# Altium schematic sheet US_SB_Orinet.SchDoc
size A4
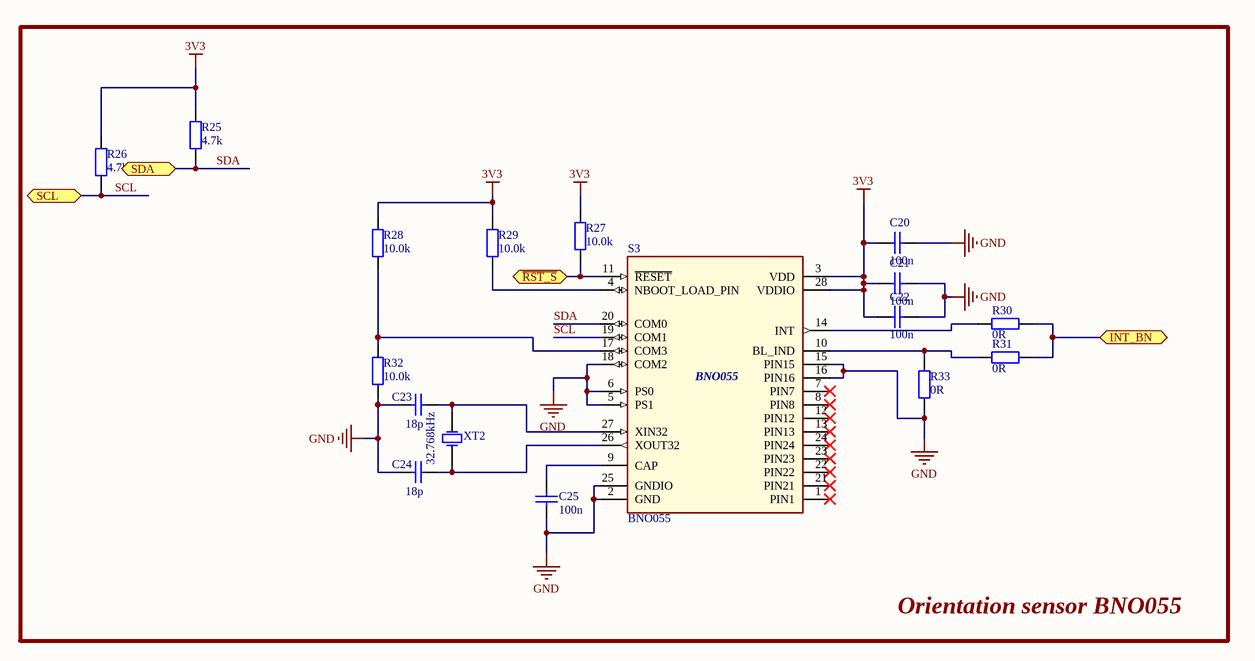
[diagram p0: US_SB_Orinet.SchDoc]

## Parts
C20  100n  [C0603_IPC_HD]
C21  100n  [C0603_IPC_HD]
C22  100n  [C0603_IPC_HD]
C23  18p  [C0603_IPC_HD]
C24  18p  [C0603_IPC_HD]
C25  100n  [C0603_IPC_HD]
R25  4.7k  [R0603_IPC_HD]
R26  4.7k  [R0603_IPC_HD]
R27  10.0k  [R0603_IPC_MD]
R28  10.0k  [R0603_IPC_MD]
R29  10.0k  [R0603_IPC_MD]
R30  0R  [R0603_IPC_MD]
R31  0R  [R0603_IPC_MD]  (no BOM)
R32  10.0k  [R0603_IPC_MD]
R33  0R  [R0603_IPC_MD]
S3  BNO055  [BNO055_LGA28R50P4X10_380X520X100]
XT2  32.768kHz  [FC-135R]

## Blocks framed on the sheet
Orientation sensor BNO055: C20-C25 R25-R33 S3 XT2

## Ports
INT_BN, SCL, SDA, ~{RST_S}

## Nets
3V3: C20.1 C21.1 C22.1 R25.2 R26.2 R27.2 R28.2 R29.2 S3.3(VDD) S3.28(VDDIO)
GND: C20.2 C21.2 C22.2 C23.1 C24.1 C25.1 R32.1 R33.1 S3.2(GND) S3.5(PS1) S3.6(PS0) S3.15(PIN15) S3.16(PIN16) S3.18(COM2) S3.25(GNDIO)
~{RST_S}: R27.1 S3.11(~{RESET}) ; port ~{RST_S}
INT_BN: R30.1 R31.1 ; port INT_BN
SCL: R26.1 S3.19(COM1) ; port SCL
SDA: R25.1 S3.20(COM0) ; port SDA
NetC23_2: C23.2 S3.27(XIN32) XT2.2(OSC2)
NetC24_2: C24.2 S3.26(XOUT32) XT2.1(OSC1)
NetC25_2: C25.2 S3.9(CAP)
NetR28_1: R28.1 R32.2 S3.17(COM3)
NetR29_1: R29.1 S3.4(NBOOT_LOAD_PIN)
NetR30_2: R30.2 S3.14(INT)
NetR31_2: R31.2 R33.2 S3.10(BL_IND)

Not connected (* = marked no-connect by the designer): S3 1(PIN1)* 7(PIN7)* 8(PIN8)* 12(PIN12)* 13(PIN13)* 21(PIN21)* 22(PIN22)* 23(PIN23)* 24(PIN24)*

## Library data of the parts
C20-C22 C25 = CL10B104KO8NNNC: CAP CER 0.1UF 16V X7R 0603; Manufacturer: Samsung Electro-Mechanics; Manufacturer Part Number: CL10B104KO8NNNC; Voltage: 16V; Value: 100n; Dielectric: X7R; Supplier 1: Digi-Key; Supplier Part Number 1: 1276-1005-1-ND
C23 C24 = CL10C180JB8NNNC: CAP CER 18PF 50V C0G/NP0 0603; Manufacturer: Samsung Electro-Mechanics; Manufacturer Part Number: CL10C180JB8NNNC; Voltage: 50V; Value: 18p; Dielectric: C0G/NP0; Supplier 1: Digi-Key; Supplier Part Number 1: 1276-1089-1-ND
R25 R26 = CR0603-JW-4.7k: RES SMD 4.7K OHM 5% 1/10W 0603; Manufacturer: Bourns Inc.; Manufacturer Part Number: CR0603-JW-472ELF; Value: 4.7k; Tolarance: ±5%; Supplier 1: Digi-Key; Supplier Part Number 1: CR0603-JW-472ELFCT-ND
R27-R29 R32 = RMCF0603FT10K0: RES 10K OHM 1% 1/10W 0603; Manufacturer: Stackpole Electronics Inc; Value: 10.0k; Tolarance: 1%; Manufacturer Part Number: RMCF0603FT10K0; Supplier 1: Digi-Key; Supplier Part Number 1: RMCF0603FT10K0CT-ND
R30 R31 R33 = CR0603-J/-000ELF: RES SMD 0 OHM JUMPER 1/10W 0603; Manufacturer: Bourns Inc.; Tolarance: 1%; Value: 0R; Manufacturer Part Number: CR0603-J/-000ELF; Supplier 1: Digi-Key; Supplier Part Number 1: CR0603-J/-000ELFCT-ND
S3 = BNO055: Accelerometer, Gyroscope, Magnetometer, 3 Axis Sensor I²C, UART Output; Manufacturer: Bosch Sensortec; Manufacturer Part Number: BNO055; Supplier 1: Digi-Key; Supplier Part Number 1: 828-1058-1-ND
XT2 = FC-135-32.7680K: 32.768kHz ±20ppm Crystal 12.5pF 70 kOhms 2-SMD, No Lead; Manufacturer: EPSON; Manufacturer Part Number: FC-135 32.7680KA-A5; Frequency: 32.768kHz; Tolarance: ±20ppm; Supplier 1: Digi-Key; Supplier Part Number 1: SER4103CT-ND